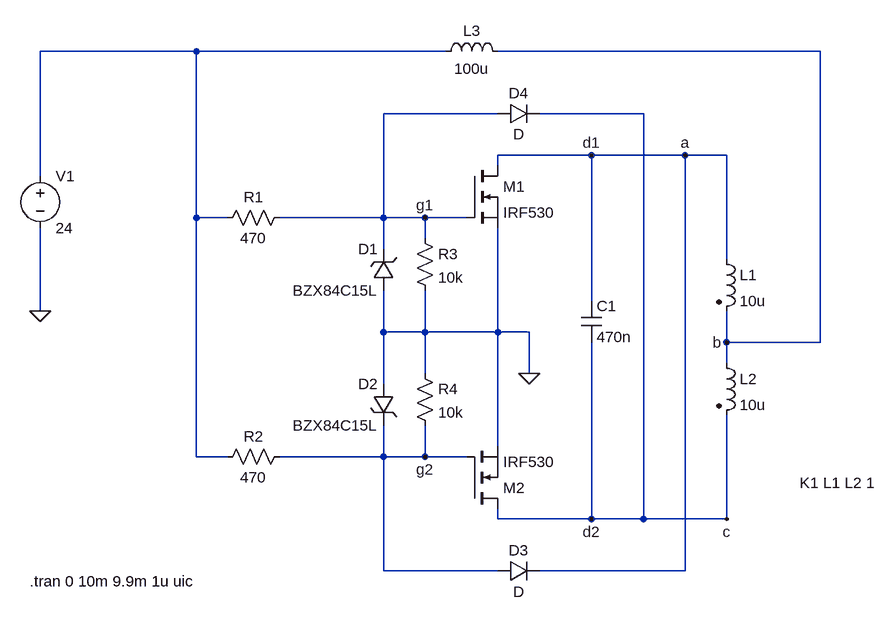
[diagram p0: schematic Self_Osc_Pushpull_ZVS.asc]
Self_Osc_Pushpull_ZVS.asc, the LTspice schematic file:
Version 4
SHEET 1 996 680
WIRE -96 -256 -336 -256
WIRE 288 -256 -96 -256
WIRE 864 -256 368 -256
WIRE 368 -160 192 -160
WIRE 592 -160 432 -160
WIRE 512 -96 368 -96
WIRE 656 -96 512 -96
WIRE 720 -96 656 -96
WIRE 368 -80 368 -96
WIRE -336 -64 -336 -256
WIRE -96 0 -96 -256
WIRE -48 0 -96 0
WIRE 192 0 192 -160
WIRE 192 0 32 0
WIRE 256 0 192 0
WIRE 320 0 256 0
WIRE 256 32 256 0
WIRE 192 48 192 0
WIRE 720 64 720 -96
WIRE 512 128 512 -96
WIRE -336 144 -336 16
WIRE 192 176 192 112
WIRE 256 176 256 112
WIRE 256 176 192 176
WIRE 368 176 368 16
WIRE 368 176 256 176
WIRE 416 176 368 176
WIRE 720 192 720 144
WIRE 864 192 864 -256
WIRE 864 192 720 192
WIRE 720 224 720 192
WIRE 256 240 256 176
WIRE 416 240 416 176
WIRE 192 256 192 176
WIRE 368 352 368 176
WIRE -96 368 -96 0
WIRE -48 368 -96 368
WIRE 192 368 192 320
WIRE 192 368 32 368
WIRE 256 368 256 320
WIRE 256 368 192 368
WIRE 320 368 256 368
WIRE 368 464 368 448
WIRE 512 464 512 192
WIRE 512 464 368 464
WIRE 592 464 592 -160
WIRE 592 464 512 464
WIRE 720 464 720 304
WIRE 720 464 592 464
WIRE 192 544 192 368
WIRE 368 544 192 544
WIRE 656 544 656 -96
WIRE 656 544 432 544
FLAG 416 240 0
FLAG -336 144 0
FLAG 256 0 g1
FLAG 256 368 g2
FLAG 512 -96 d1
FLAG 512 464 d2
FLAG 656 -96 a
FLAG 720 192 b
FLAG 720 464 c
SYMBOL voltage -336 -80 R0
WINDOW 123 0 0 Left 2
WINDOW 39 0 0 Left 2
SYMATTR InstName V1
SYMATTR Value 24
SYMBOL nmos 320 -80 R0
SYMATTR InstName M1
SYMATTR Value IRF530
SYMBOL nmos 320 448 M180
SYMATTR InstName M2
SYMATTR Value IRF530
SYMBOL res 48 -16 R90
WINDOW 0 0 56 VBottom 2
WINDOW 3 32 56 VTop 2
SYMATTR InstName R1
SYMATTR Value 470
SYMBOL res 48 352 R90
WINDOW 0 0 56 VBottom 2
WINDOW 3 32 56 VTop 2
SYMATTR InstName R2
SYMATTR Value 470
SYMBOL ind2 704 48 R0
SYMATTR InstName L1
SYMATTR Value 10u
SYMATTR Type ind
SYMBOL ind2 704 208 R0
SYMATTR InstName L2
SYMATTR Value 10u
SYMATTR Type ind
SYMBOL ind 272 -240 R270
WINDOW 0 32 56 VTop 2
WINDOW 3 5 56 VBottom 2
SYMATTR InstName L3
SYMATTR Value 100u
SYMBOL cap 496 128 R0
SYMATTR InstName C1
SYMATTR Value 470n
SYMBOL res 240 16 R0
SYMATTR InstName R3
SYMATTR Value 10k
SYMBOL res 240 224 R0
SYMATTR InstName R4
SYMATTR Value 10k
SYMBOL zener 208 112 R180
WINDOW 0 24 64 Left 2
WINDOW 3 24 0 Left 2
SYMATTR InstName D1
SYMATTR Value BZX84C15L
SYMATTR Description Diode
SYMATTR Type diode
SYMBOL zener 208 256 M0
SYMATTR InstName D2
SYMATTR Value BZX84C15L
SYMATTR Description Diode
SYMATTR Type diode
SYMBOL diode 368 560 R270
WINDOW 0 32 32 VTop 2
WINDOW 3 0 32 VBottom 2
SYMATTR InstName D3
SYMBOL diode 368 -144 R270
WINDOW 0 32 32 VTop 2
WINDOW 3 0 32 VBottom 2
SYMATTR InstName D4
TEXT -352 560 Left 2 !.tran 0 10m 9.9m 1u uic
TEXT 832 408 Left 2 !K1 L1 L2 1

The netlist it stands for:
* Self_Osc_Pushpull_ZVS.asc
V1 N001 0 24
M1 a g1 0 0 IRF530
M2 c g2 0 0 IRF530
R1 g1 N001 470
R2 g2 N001 470
L1 a b 10u
L2 b c 10u
L3 N001 b 100u
C1 a c 470n
R3 g1 0 10k
R4 0 g2 10k
D1 0 g1 BZX84C15L
D2 0 g2 BZX84C15L
D3 g2 a D
D4 g1 c D
.model D D
.lib standard.dio
.model NMOS NMOS
.model PMOS PMOS
.lib standard.mos
.tran 0 10m 9.9m 1u uic
K1 L1 L2 1
.backanno
.end